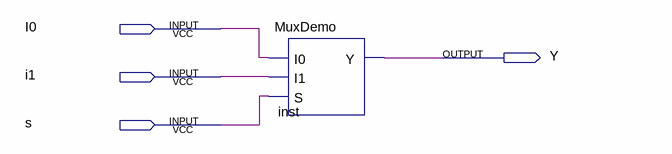
[diagram p0: schematic sheet]
// Quartus schematic Block2.bdf as structural Verilog: 1 symbols, 4 pins
module Block2 (
  input  I0,
  input  i1,
  input  s,
  output Y
);

  MuxDemo inst (.I0(I0), .I1(i1), .S(s), .Y(Y));
endmodule
